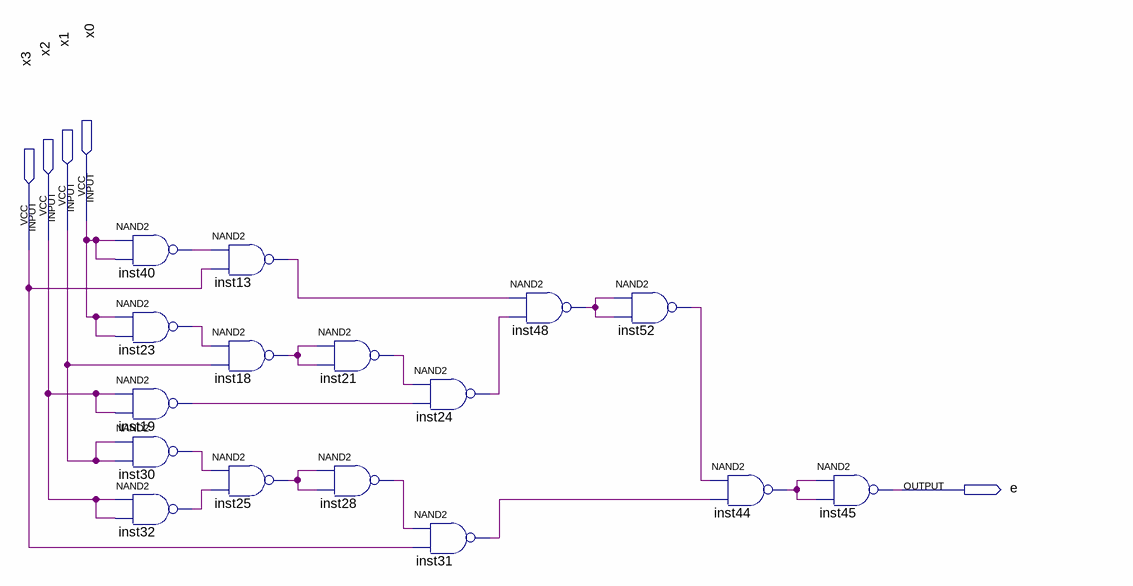
[diagram p0: schematic sheet]
// Quartus schematic DZ1_Quartus_E.bdf as structural Verilog: 16 symbols, 5 pins
module DZ1_Quartus_E (
  input  x0,
  input  x1,
  input  x2,
  input  x3,
  output e
);

  wire inst13_out, inst18_out, inst19_out, inst21_out, inst23_out, inst24_out, inst25_out, inst28_out,
       inst30_out, inst31_out, inst32_out, inst40_out, inst44_out, inst48_out, inst52_out;

  nand inst40 (inst40_out, x0, x0);
  nand inst23 (inst23_out, x0, x0);
  nand inst19 (inst19_out, x2, x2);
  nand inst30 (inst30_out, x1, x1);
  nand inst32 (inst32_out, x2, x2);
  nand inst13 (inst13_out, inst40_out, x3);
  nand inst18 (inst18_out, inst23_out, x1);
  nand inst25 (inst25_out, inst30_out, inst32_out);
  nand inst21 (inst21_out, inst18_out, inst18_out);
  nand inst28 (inst28_out, inst25_out, inst25_out);
  nand inst24 (inst24_out, inst21_out, inst19_out);
  nand inst31 (inst31_out, inst28_out, x3);
  nand inst48 (inst48_out, inst13_out, inst24_out);
  nand inst52 (inst52_out, inst48_out, inst48_out);
  nand inst44 (inst44_out, inst52_out, inst31_out);
  nand inst45 (e, inst44_out, inst44_out);
endmodule
